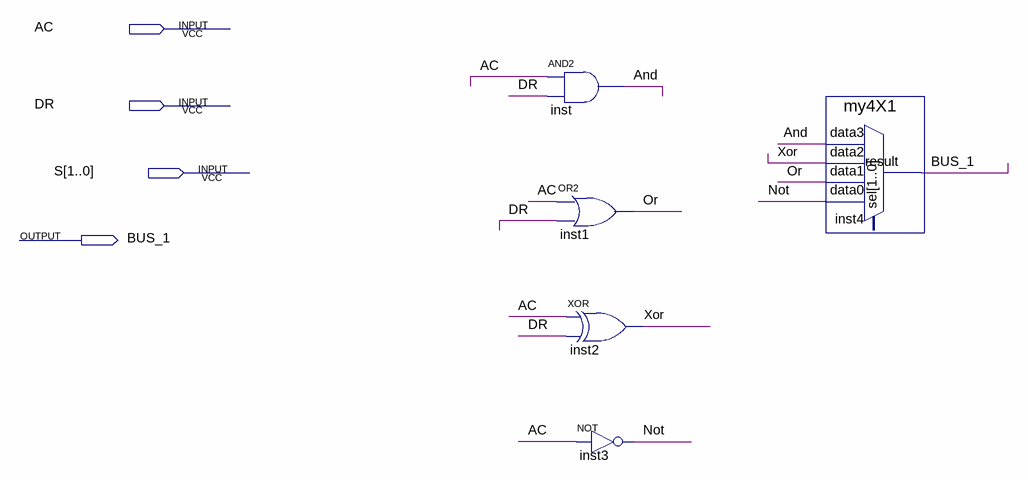
[diagram p0: schematic sheet]
// Quartus schematic lojik.bdf as structural Verilog: 5 symbols, 4 pins
module lojik (
  input  AC,
  input  DR,
  input  [1:0] S,
  output BUS_1
);

  wire And, Not, Or, Xor;

  and inst (And, AC, DR);
  or inst1 (Or, AC, DR);
  xor inst2 (Xor, AC, DR);
  not inst3 (Not, AC);
  my4X1 inst4 (.data3(And), .data2(Xor), .data1(Or), .data0(Not), .result(BUS_1));  // open: sel
endmodule
